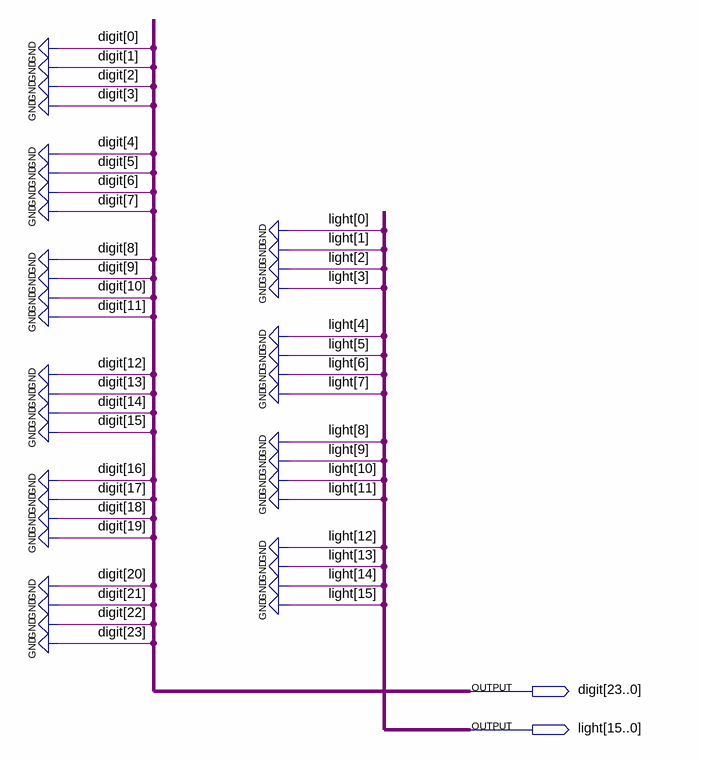
[diagram p0: schematic sheet]
// Quartus schematic Pattern_7_Frame_15.bdf as structural Verilog: 0 symbols, 2 pins
module Pattern_7_Frame_15 (
  output [23:0] digit,
  output [15:0] light
);


  assign digit = {24{1'b0}};
  assign light = {16{1'b0}};
endmodule
